# Altium schematic sheet Connectors.SchDoc
size A3; SheetNumber: 5; SheetTotal: 5
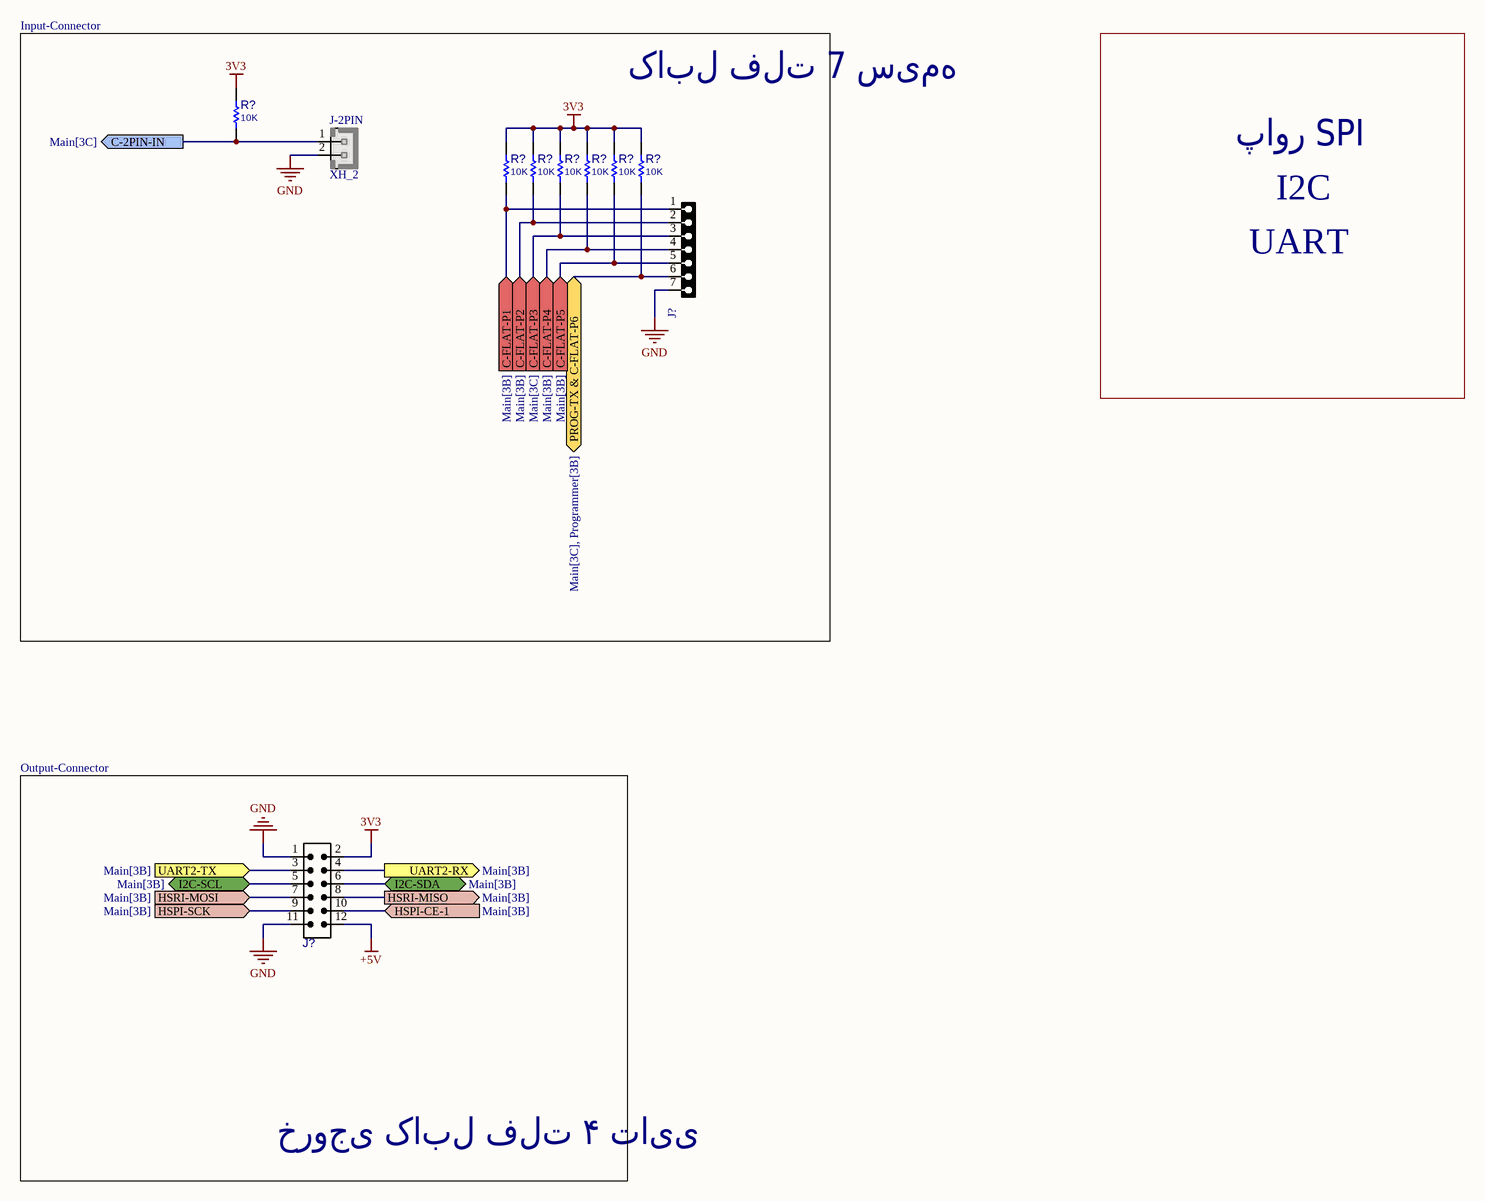
[diagram p0: Connectors.SchDoc]

## Parts
(Parts that share a designator on the sheet are numbered #1, #2 ... from top to bottom, then left to right.)
J-2PIN  XH_2  [XH_2]
J?#1  HDR1X7  [HDRMINI_F_1X7]  (value not drawn)
J?#2  IDC_2X6  [IDC_2X6]  (value not drawn)
R?#1  10K  [R0402]
R?#2  10K  [R0402]
R?#3  10K  [R0402]
R?#4  10K  [R0402]
R?#5  10K  [R0402]
R?#6  10K  [R0402]
R?#7  10K  [R0402]

## Blocks framed on the sheet
کابل فلت 7 سیمه: J-2PIN J?#1 R?#1-R?#7
خروجی کابل فلت ۴ تایی: J?#2

## Ports
C-2PIN-IN (out, see Main[3C]), C-FLAT-P1 (in, see Main[3B]), C-FLAT-P2 (in, see Main[3B]), C-FLAT-P3 (in, see Main[3C]), C-FLAT-P4 (in, see Main[3B]), C-FLAT-P5 (in, see Main[3B]), HSPI-CE-1 (in, see Main[3B]), HSPI-SCK (in, see Main[3B]), HSRI-MISO (out, see Main[3B]), HSRI-MOSI (in, see Main[3B]), I2C-SCL (bidir, see Main[3B]), I2C-SDA (bidir, see Main[3B]), PROG-TX & C-FLAT-P6 (bidir, see Main[3C], Programmer[3B]), UART2-RX (out, see Main[3B]), UART2-TX (in, see Main[3B])

## Nets
3V3: J?#2.2 R?#1.1 R?#2.1 R?#3.1 R?#4.1 R?#5.1 R?#6.1 R?#7.1
+5V: J?#2.12
GND: J-2PIN.2 J?#1.7 J?#2.1 J?#2.11
C-2PIN-IN: J-2PIN.1 R?#1.2 ; port C-2PIN-IN
C-FLAT-P1: J?#1.1 R?#2.2 ; port C-FLAT-P1
C-FLAT-P2: J?#1.2 R?#3.2 ; port C-FLAT-P2
C-FLAT-P3: J?#1.3 R?#4.2 ; port C-FLAT-P3
C-FLAT-P4: J?#1.4 R?#5.2 ; port C-FLAT-P4
C-FLAT-P5: J?#1.5 R?#6.2 ; port C-FLAT-P5
HSPI-CE-1: J?#2.10 ; port HSPI-CE-1
HSPI-SCK: J?#2.9 ; port HSPI-SCK
HSRI-MISO: J?#2.8 ; port HSRI-MISO
HSRI-MOSI: J?#2.7 ; port HSRI-MOSI
I2C-SCL: J?#2.5 ; port I2C-SCL
I2C-SDA: J?#2.6 ; port I2C-SDA
PROG-TX & C-FLAT-P6: J?#1.6 R?#7.2 ; port PROG-TX & C-FLAT-P6
UART2-RX: J?#2.4 ; port UART2-RX
UART2-TX: J?#2.3 ; port UART2-TX

## Notes on the sheet
- Input-Connector
- پاور SPI
- UART
- I2C
- Output-Connector

## Library data of the parts
J-2PIN = XH_2: PW10-x-M, JST-BxB-XH-A pitch: 2.5mm, 3A/250v; MANF: JST; MANF_P#: B2B-XH-A; PARAM2: 250v; PARAM: 3.0A; VALUE: XH_2
J?#1 = HDRMINI_F_1X7: CONN, HEADER, Female, pitch: 1.27mm, 7POS; VALUE: HDRMINI_7
J?#2 = IDC_2X6: CONN, IDC, Male, pitch: 2.54mm, 12POS; VALUE: IDC_2X6
R?#1-R?#7 = RES_SMD: RESISTOR, SMD; PARAM: -W; DESC: DESCRIPTION; DIST#: MOUSER; PARAM2: 1%; MANF_P#: -; MANF: -; ASSEMBLY: ASSEMBLY; PRICE: 100= 0.5$; VALUE: 10K